# EAGLE design ethernet_poe (EAGLE 9.5.1)
REVISION: 1.0; TEAM: RoboRacing
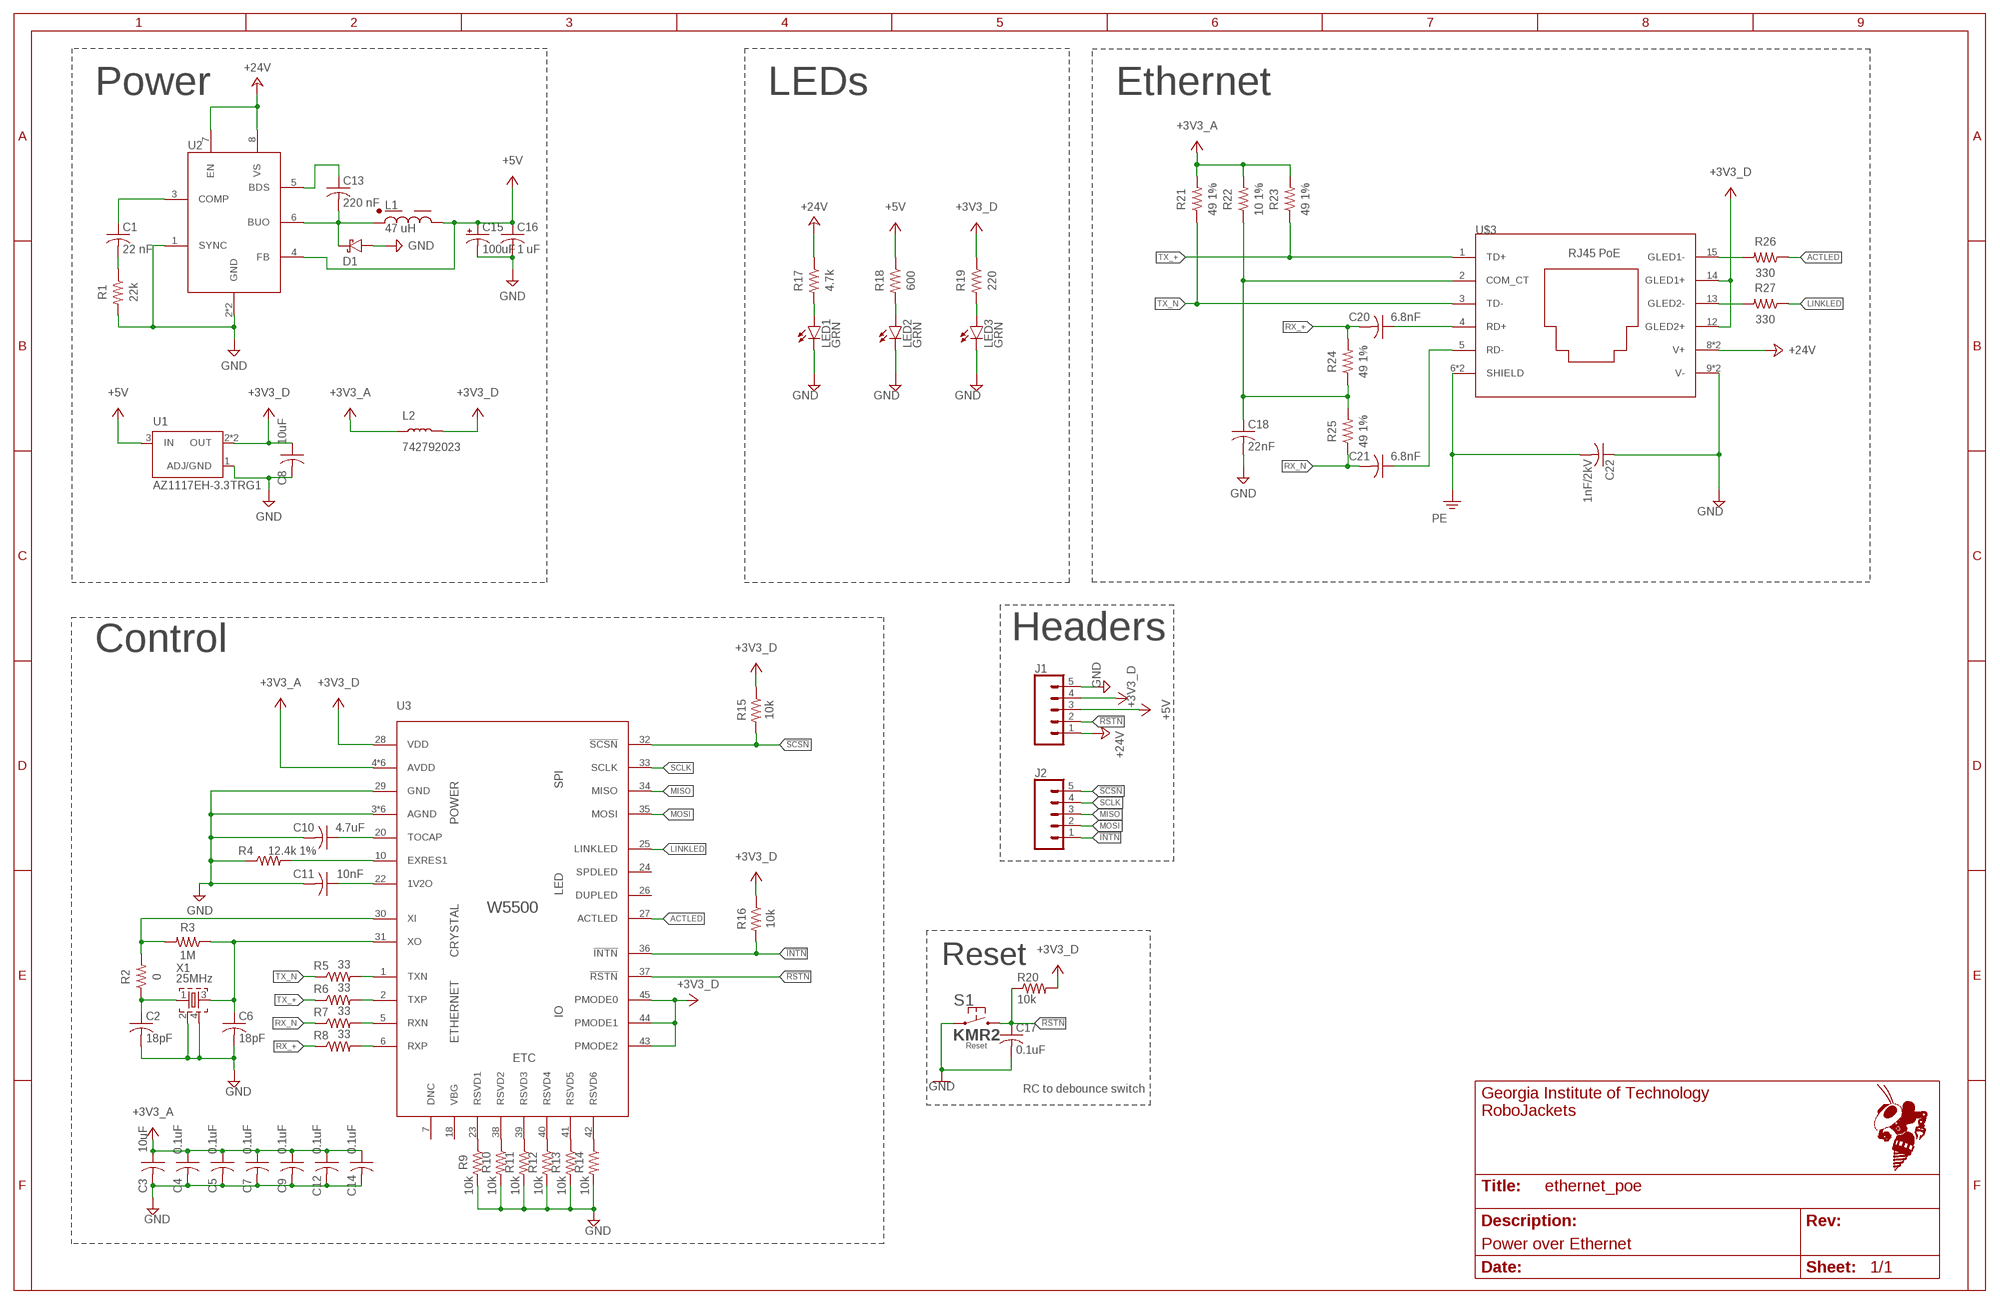
[diagram p0: schematic, sheet 1]
FRAME1 (FRAME_B_L): SCH_DESC: Power over Ethernet

## Parts
C1  22 nF  C-USC0603  [C0603]
C2  18pF  C-USC0603  [C0603]
C3  10uF  C-USC0603  [C0603]
C4  0.1uF  C-USC0603  [C0603]
C5  0.1uF  C-USC0603  [C0603]
C6  18pF  C-USC0603  [C0603]
C7  0.1uF  C-USC0603  [C0603]
C8  10uF  C-USC0603  [C0603]
C9  0.1uF  C-USC0603  [C0603]
C10  4.7uF  C-USC0603  [C0603]
C11  10nF  C-USC0603  [C0603]
C12  0.1uF  C-USC0603  [C0603]
C13  220 nF  C-USC0603  [C0603]
C14  0.1uF  C-USC0603  [C0603]
C15  100uF  CPOL-USE2-5  [E2-5]
C16  1 uF  C-USC0603  [C0603]
C17  0.1uF  C-USC0603  [C0603]
C18  22nF  C-USC0603  [C0603]
C20  6.8nF  C-USC0603  [C0603]
C21  6.8nF  C-USC0603  [C0603]
C22  1nF/2kV  C-USC1206  [C1206]
D1  SCHOTTKYSOD-323  [SOD-323]
J1  CONN_05  [1X05]
J2  CONN_05  [1X05]
L1  47 uH  744771147  [744771147]
L2  742792023  INDUCTOR_0805  [0805]
LED1  GRN  LEDCHIP-LED0603  [CHIP-LED0603]
LED2  GRN  LEDCHIP-LED0603  [CHIP-LED0603]
LED3  GRN  LEDCHIP-LED0603  [CHIP-LED0603]
R1  22k  R-US_R0603  [R0603]
R2  0  R-US_R0603  [R0603]
R3  1M  R-US_R0603  [R0603]
R4  12.4k 1%  R-US_R0603  [R0603]
R5  33  R-US_R0603  [R0603]
R6  33  R-US_R0603  [R0603]
R7  33  R-US_R0603  [R0603]
R8  33  R-US_R0603  [R0603]
R9  10k  R-US_R0603  [R0603]
R10  10k  R-US_R0603  [R0603]
R11  10k  R-US_R0603  [R0603]
R12  10k  R-US_R0603  [R0603]
R13  10k  R-US_R0603  [R0603]
R14  10k  R-US_R0603  [R0603]
R15  10k  R-US_R0603  [R0603]
R16  10k  R-US_R0603  [R0603]
R17  4.7k  R-US_R0603  [R0603]
R18  600  R-US_R0603  [R0603]
R19  220  R-US_R0603  [R0603]
R20  10k  R-US_R0603  [R0603]
R21  49 1%  R-US_R0603  [R0603]
R22  10 1%  R-US_R0603  [R0603]
R23  49 1%  R-US_R0603  [R0603]
R24  49 1%  R-US_R0603  [R0603]
R25  49 1%  R-US_R0603  [R0603]
R26  330  R-US_R0603  [R0603]
R27  330  R-US_R0603  [R0603]
S1  KMR2  [KMR2]
U1  AZ1117EH-3.3TRG1  [SOT230P700X180-4N]
U2  IFX91041  [SOIC-8-EXPOSED_PAD]
U3  W5500  [48-LQFP]
U$3  SI-52003-F  [SI-52003-F]
X1  25MHz  ABM10W-25.0000MHZ-6-K1Z-T3  [OSCILLATOR-SMD-2.5X2]

## Nets
3V3_LED: LED3.A R19.2
5V_LED: LED2.A R18.2
24V_LED: LED1.A R17.2
!INTN: J2.1 R16.2 U3.36(!INTN)
!RSTN: C17.1 J1.2 R20.1 S1.2.1 S1.2.2 U3.37(!RSTN)
!SCSN: J2.5 R15.2 U3.32(!SCSN)
+3V3_A: C3.1 C4.1 C5.1 C7.1 C9.1 C12.1 C14.1 L2.1 R21.2 R22.2 R23.2 U3.4(AVDD) U3.8(AVDD) U3.11(AVDD) U3.15(AVDD) U3.17(AVDD) U3.21(AVDD)
+3V3_D [power]: C8.1 J1.4 L2.2 R15.1 R16.1 R19.1 R20.2 U1.2(OUT) U1.4(OUT) U3.28(VDD) U3.43(PMODE2) U3.44(PMODE1) U3.45(PMODE0) U$3.12(GLED2+) U$3.14(GLED1+)
+5V: C15.+ C16.1 J1.3 L1.1 R18.1 U1.3(IN) U2.4(FB)
+24V: J1.1 R17.1 U2.7(EN) U2.8(VS) U$3.8(V+) U$3.10(V+)
ACTLED: R26.1 U3.27(ACTLED)
COM_CT: C18.1 R22.1 R24.1 R25.2 U$3.2(COM_CT)
GND: C2.2 C3.2 C4.2 C5.2 C6.2 C7.2 C8.2 C9.2 C10.2 C11.2 C12.2 C14.2 C15.- C16.2 C17.2 C18.2 C22.1 D1.A J1.5 LED1.C LED2.C LED3.C R1.2 R4.1 R9.2 R10.2 R11.2 R12.2 R13.2 R14.2 S1.1.1 S1.1.2 U1.1(ADJ/GND) U2.1(SYNC) U2.2(GND) U2.P$9(GND) U3.3(AGND) U3.9(AGND) U3.14(AGND) U3.16(AGND) U3.19(AGND) U3.29(GND) U3.48(AGND) U$3.9(V-) U$3.11(V-) X1.2(SHD1) X1.4(SHD2)
LINKLED: R27.1 U3.25(LINKLED)
MISO: J2.3 U3.34(MISO)
MOSI: J2.2 U3.35(MOSI)
N$1: R9.1 U3.23(RSVD1)
N$2: R10.1 U3.38(RSVD2)
N$3: R11.1 U3.39(RSVD3)
N$4: R5.2 U3.1(TXN)
N$5: R6.2 U3.2(TXP)
N$6: R12.1 U3.40(RSVD4)
N$7: R7.2 U3.5(RXN)
N$8: R8.2 U3.6(RXP)
N$9: C2.1 R2.1 X1.1(IN)
N$10: R27.2 U$3.13(GLED2-)
N$11: C6.1 R3.1 U3.31(XO) X1.3(OUT)
N$12: R26.2 U$3.15(GLED1-)
N$13: R2.2 R3.2 U3.30(XI)
N$14: C13.2 D1.C L1.P$2 U2.6(BUO)
N$15: C13.1 U2.5(BDS)
N$16: C1.2 R1.1
N$17: C1.1 U2.3(COMP)
N$18: C11.1 U3.22(1V2O)
N$19: C10.1 U3.20(TOCAP)
N$20: R13.1 U3.41(RSVD5)
N$21: R4.2 U3.10(EXRES1)
N$22: R14.1 U3.42(RSVD6)
PE: C22.2 U$3.6(SHIELD) U$3.7(SHIELD)
RD_+: C20.1 U$3.4(RD+)
RD_N: C21.1 U$3.5(RD-)
RX_+: C20.2 R8.1 R24.2
RX_N: C21.2 R7.1 R25.1
SCLK: J2.4 U3.33(SCLK)
TX_+: R6.1 R23.1 U$3.1(TD+)
TX_N: R5.1 R21.1 U$3.3(TD-)
Unconnected: U3.7(DNC) U3.18(VBG) U3.24(SPDLED) U3.26(DUPLED)

## Notes on the sheet
- Power | LEDs | Ethernet
- Headers
- Control
- Reset
- RC to debounce switch

## Library data of the parts
C1-C14 C16-C18 C20-C22 = rcl:C-US: CAPACITOR, American symbol; SPICEPREFIX: C
C15 = rcl:CPOL-US: POLARIZED CAPACITOR, American symbol; SPICEPREFIX: C
D1 = RoboJackets-Diodes:SCHOTTKY
J1 J2 = SparkFun-Connectors:CONN_05: Multi connection point. Often used as Generic Header-pin footprint for 0.1 inch spaced/style header connections On any of the 0.1 inch spaced packages, you can populate with these: Break Away Headers - Straight <https://www.sparkfun.com/products/116> (PRT-00116) Break Away Male Headers - Right Angle <https://www.sparkfun.com/products/553> (PRT-00553) Female Headers <https://www.sparkfun.com/products/115> (PRT-00115) Break Away Headers - Machine Pin <https://www.sparkfun.com/products/117> (PRT-00117) Break Away Female Headers - Swiss Machine Pin <https://www.sparkfun.com/products/743> (PRT-00743) For SCREWTERMINALS and SPRING TERMINALS visit here: Screw Terimnals on SparkFun.com <https://www.sparkfun.com/search/results?term=Screw+Terminals> (5mm/3.5mm/2.54mm spacing) This device is also useful as a general connection point to wire up your design to another part of your project. Our various solder wires solder well into these plated through hole pads. Hook-Up Wire - Assortment (Stranded, 22 AWG) <https://www.sparkfun.com/products/11375> (PRT-11375) Hook-Up Wire - Assortment (Solid Core, 22 AWG) <https://www.sparkfun.com/products/11367> (PRT-11367) View the entire wire category on our website here <https://www.sparkfun.com/categories/141> Special notes: Molex polarized connector foot print use with SKU : PRT-08231 with associated crimp pins and housings. 1MM SMD Version SKU: PRT-10208
L1 = ethernet_poe:744771147: Wurth Elektronik SMT Shielded Power Inductor; DKPN: 732-1214-1-ND
L2 = ethernet_poe:INDUCTOR_0805
LED1-LED3 = led:LED: LED OSRAM: - CHIPLED LG R971, LG N971, LY N971, LG Q971, LY Q971, LO R971, LY R971 LH N974, LH R974 LS Q976, LO Q976, LY Q976 LO Q996 - Hyper CHIPLED LW Q18S LB Q993, LB Q99A, LB R99A - SideLED LS A670, LO A670, LY A670, LG A670, LP A670 LB A673, LV A673, LT A673, LW A673 LH A674 LY A675 LS A676, LA A676, LO A676, LY A676, LW A676 LS A679, LY A679, LG A679 - Hyper Micro SIDELED® LS Y876, LA Y876, LO Y876, LY Y876 LT Y87S - SmartLED LW L88C, LW L88S LB L89C, LB L89S, LG L890 LS L89K, LO L89K, LY L89K LS L896, LA L896, LO L896, LY L896 - TOPLED LS T670, LO T670, LY T670, LG T670, LP T670 LSG T670, LSP T670, LSY T670, LOP T670, LYG T670 LG T671, LOG T671, LSG T671 LB T673, LV T673, LT T673, LW T673 LH T674 LS T676, LA T676, LO T676, LY T676, LB T676, LH T676, LSB T676, LW T676 LB T67C, LV T67C, LT T67C, LS T67K, LO T67K, LY T67K, LW E67C LS E67B, LA E67B, LO E67B, LY E67B, LB E67C, LV E67C, LT E67C LW T67C LS T679, LY T679, LG T679 LS T770, LO T770, LY T770, LG T770, LP T770 LB T773, LV T773, LT T773, LW T773 LH T774 LS E675, LA E675, LY E675, LS T675 LS T776, LA T776, LO T776, LY T776, LB T776 LHGB T686 LT T68C, LB T68C - Hyper Mini TOPLED® LB M676 - Mini TOPLED Santana® LG M470 LS M47K, LO M47K, LY M47K Source: http://www.osram.convergy.de LUXEON: - LUMILED® LXK2-PW12-R00, LXK2-PW12-S00, LXK2-PW14-U00, LXK2-PW14-V00 LXK2-PM12-R00, LXK2-PM12-S00, LXK2-PM14-U00 LXK2-PE12-Q00, LXK2-PE12-R00, LXK2-PE12-S00, LXK2-PE14-T00, LXK2-PE14-U00 LXK2-PB12-K00, LXK2-PB12-L00, LXK2-PB12-M00, LXK2-PB14-N00, LXK2-PB14-P00, LXK2-PB14-Q00 LXK2-PR12-L00, LXK2-PR12-M00, LXK2-PR14-Q00, LXK2-PR14-R00 LXK2-PD12-Q00, LXK2-PD12-R00, LXK2-PD12-S00 LXK2-PH12-R00, LXK2-PH12-S00 LXK2-PL12-P00, LXK2-PL12-Q00, LXK2-PL12-R00 Source: www.luxeon.com KINGBRIGHT: KA-3528ASYC Source: www.kingbright.com
R1-R27 = rcl:R-US_: RESISTOR, American symbol; SPICEPREFIX: R
S1 = RoboJackets-Switches:KMR2; FUNCTION: Reset
U1 = ethernet_poe:AZ1117EH-3.3TRG1: Ldo.Vreg Pos 3, 3v 1a Sot223; DKPN: AZ1117EH-3.3TRG1DICT-ND
U2 = ethernet_poe:IFX91041: 1.8A DC/DC Step-Down Voltage Regulator 5.0V, 3.3V, or Adjustable Output; DKPN: IFX91041EJV50XUMA1CT-ND
U3 = ethernet_poe:W5500: Chip to control 10/100 Ethernet and output data over SPI; DKPN: 1278-1021-ND
U$3 = ethernet_poe:SI-52003-F
X1 = ethernet_poe:ABM10W-25.0000MHZ-6-K1Z-T3: 25 MHz Oscillator; DKPN: 535-13730-1-ND

## Net classes
0 default: width 0.203 mm, drill 0.406 mm, clearance 0.203 mm
1 power: width 0.305 mm, drill 0.406 mm, clearance 0.203 mm to class 0, clearance 0.203 mm

## Board
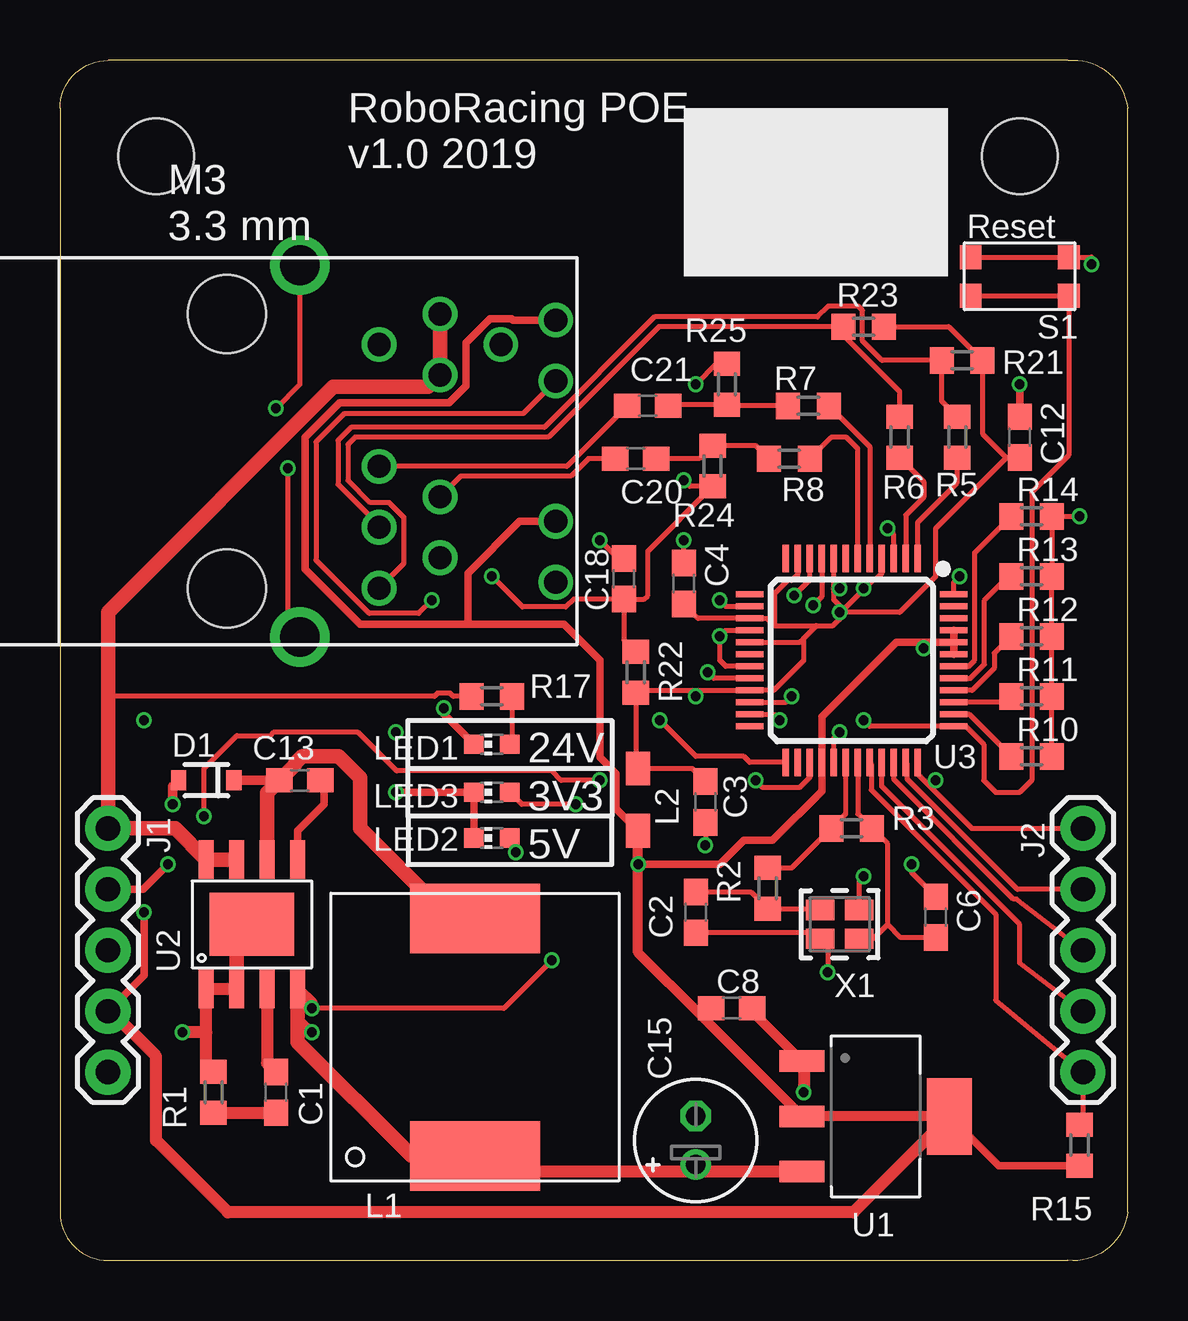
[diagram p1: board, top side]
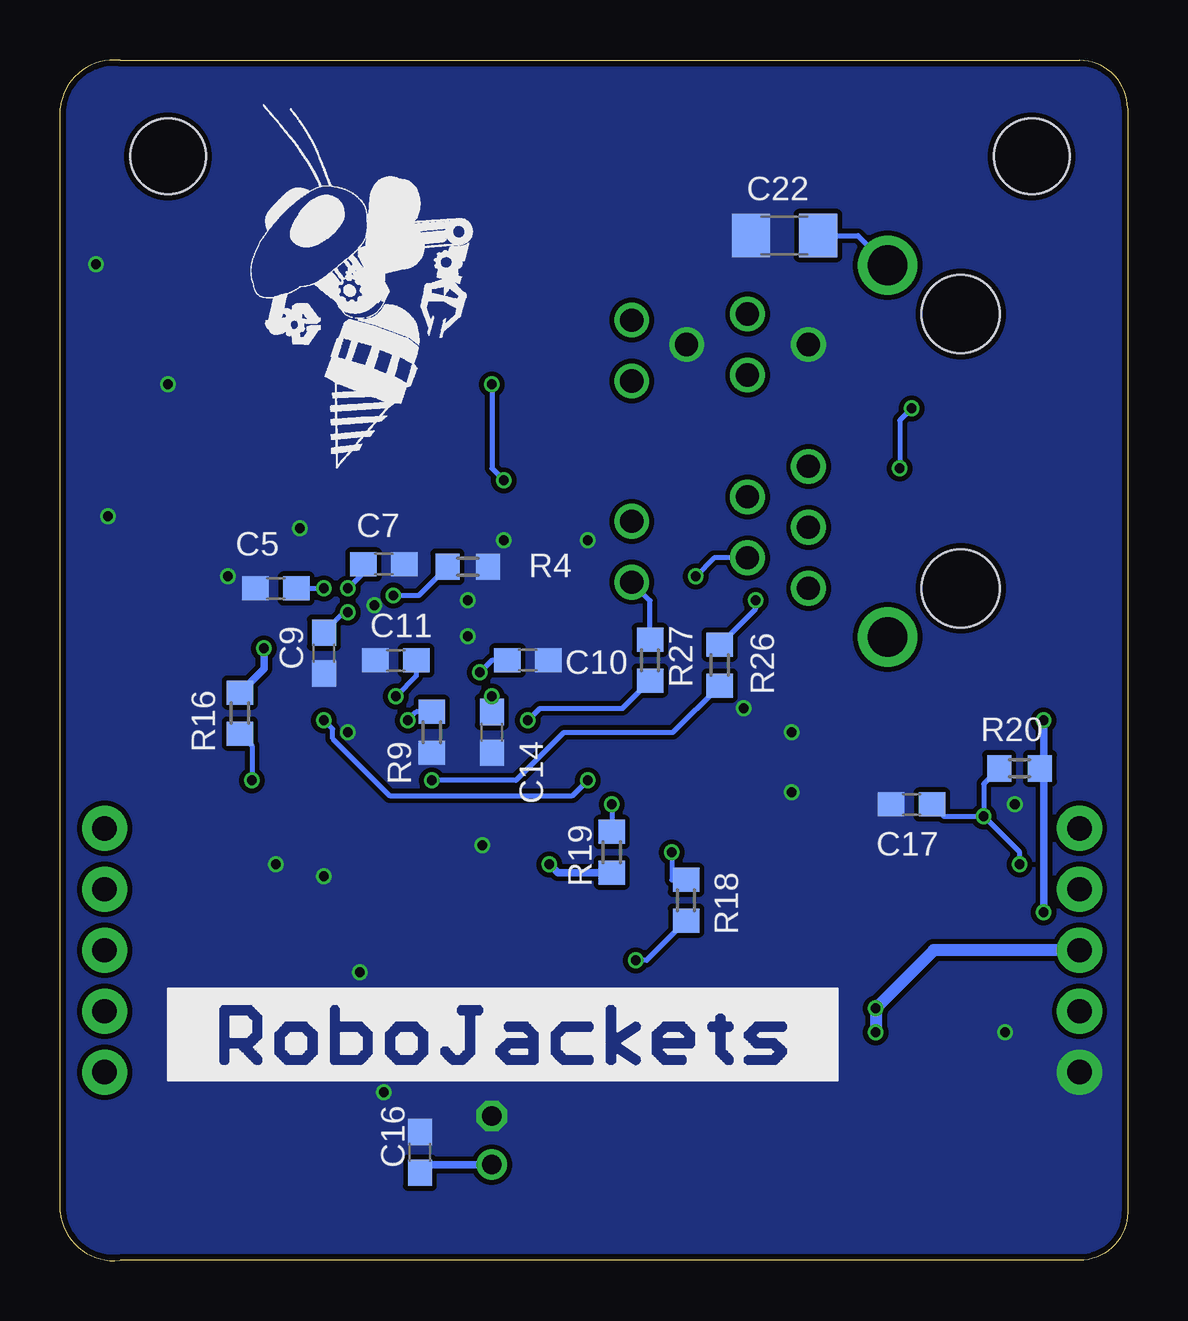
[diagram p2: board, bottom side, seen from below]

Size 44.5 x 50.03 mm. Coordinates in mm from the lower left corner, seen from the top.
Outline: 2,0.01 42,0.01 arc90 44.5,2.01 44.5,48.01 arc90 42,50.01 2,50.01 arc90 0,48.01 0,2.01 arc90 2,0.01
Copper layers (1*16): Top 0.018mm / dielectric 1.55mm / Bottom 0.018mm
Design rules "eC_2Layer_PClass6_BaseCopperO18_eCDefault": minimum track width 0.15mm, minimum drill 0.35mm, track to track 0.15mm, track to pad 0.15mm, pad to pad 0.15mm, via to via 0.15mm, smd to smd 0mil, copper to edge 0.25mm, drill to drill 0.35mm, minimum pad ring 0.175mm, minimum via ring 0.125mm, stop-mask expansion 0mil, vias tented up to drill 0.45mm, thermal gap 0.2mm
Holes 3.15 mm at 40,46.01 4,46.01

### Footprints (pad centres in the part's own frame; a part is rotated, then mirrored left to right if it is on the bottom)
C0603 = smd 1.1 x 1: 1 -0.85,0; 2 0.85,0
E2-5 = drill 0.813 pad 1.27: + -1.016,0 | drill 0.813 pad 1.27 octagon: - 1.016,0
C1206 = smd 1.6 x 1.8: 1 -1.4,0; 2 1.4,0
SOD-323 = smd 0.63 x 0.83: A 1.15,0; C -1.15,0
1X05 = drill 1.016 pad 1.88: 1 0,0; 2 2.54,0; 3 5.08,0; 4 7.62,0; 5 10.16,0
744771147 = smd 5.4 x 2.9: 1 0,4.95; P$2 0,-4.95
0805 = smd 1.4 x 1: 1 -1.3,0; 2 1.3,0
CHIP-LED0603 = smd 0.8 x 0.8: A 0,-0.75; C 0,0.75
R0603 = smd 1 x 1.1: 1 -0.85,0; 2 0.85,0
KMR2 = smd 0.9 x 1: 1.1 -2.05,0.8; 1.2 2.05,0.8; 2.1 -2.05,-0.8; 2.2 2.05,-0.8
SOT230P700X180-4N = smd 1.86 x 0.9: 1 -3.075,2.3; 2 -3.075,0; 3 -3.075,-2.3 | smd 1.86 x 3.19: 4 3.075,0
SOIC-8-EXPOSED_PAD = smd 1.6 x 0.61: 1 -2.7,1.905; 2 -2.7,0.635; 3 -2.7,-0.635; 4 -2.7,-1.905; 5 2.7,-1.905; 6 2.7,-0.635; 7 2.7,0.635; 8 2.7,1.905 | smd 2.62 x 3.51: P$9 0,0
48-LQFP = smd 1.143 x 0.254: 1 -4.25,2.75; 2 -4.25,2.25; 3 -4.25,1.75; 4 -4.25,1.25; 5 -4.25,0.75; 6 -4.25,0.25; 7 -4.25,-0.25; 8 -4.25,-0.75; 9 -4.25,-1.25; 10 -4.25,-1.75; 11 -4.25,-2.25; 12 -4.25,-2.75; 25 4.25,-2.75; 26 4.25,-2.25; 27 4.25,-1.75; 28 4.25,-1.25; 29 4.25,-0.75; 30 4.25,-0.25; 31 4.25,0.25; 32 4.25,0.75; 33 4.25,1.25; 34 4.25,1.75; 35 4.25,2.25; 36 4.25,2.75 | smd 0.254 x 1.143: 13 -2.75,-4.25; 14 -2.25,-4.25; 15 -1.75,-4.25; 16 -1.25,-4.25; 17 -0.75,-4.25; 18 -0.25,-4.25; 19 0.25,-4.25; 20 0.75,-4.25; 21 1.25,-4.25; 22 1.75,-4.25; 23 2.25,-4.25; 24 2.75,-4.25; 37 2.75,4.25; 38 2.25,4.25; 39 1.75,4.25; 40 1.25,4.25; 41 0.75,4.25; 42 0.25,4.25; 43 -0.25,4.25; 44 -0.75,4.25; 45 -1.25,4.25; 46 -1.75,4.25; 47 -2.25,4.25; 48 -2.75,4.25
SI-52003-F = drill 0.965: 1 0,0; 2 -1.27,2.54; 3 -2.54,0; 4 -3.81,2.54; 5 -5.08,0; 8 -8.89,2.54; 9 -10.16,0; 10 -11.43,2.54; 11 -10.16,5.08; 12 -2.794,7.366; 13 -0.254,7.366; 14 -11.176,7.366; 15 -8.636,7.366 | drill 1.651: 6 2.032,-3.302; 7 -13.462,-3.302 | hole 3.251: 0,-6.35; -11.43,-6.35
OSCILLATOR-SMD-2.5X2 = smd 1.2 x 0.85: 1 -0.812,0.6; 2 0.812,0.6; 3 0.812,-0.6; 4 -0.812,-0.6

### Placement (x,y rotation side)
C1  9,7.01 270 top
C2  26.5,14.51 270 top
C3  26.9,19.11 270 top
C4  26,28.21 90 top
C5  35.5,28.01 180 bottom
C6  36.5,14.31 90 top
C7  31,29.01 0 bottom
C8  28,10.51 0 top
C9  33.5,25.31 270 bottom
C10  25,25.01 0 bottom
C11  30.5,25.01 180 bottom
C12  40,34.31 90 top
C13  10,20.01 180 top
C14  26.5,22.01 270 bottom
C15  26.5,5.01 90 top
C16  29.5,4.51 90 bottom
C17  9,19.01 180 bottom
C18  23.5,28.41 90 top
C20  24,33.41 0 top
C21  24.5,35.61 0 top
C22  14.3,42.71 0 bottom
D1  6.1,20.01 180 top
J1  2,18.01 270 top
J2  42.64,18.01 270 top
L1  17.3,9.31 180 top
L2  24.1,19.21 270 top
LED1  18,21.51 90 top
LED2  18,17.61 90 top
LED3  18,19.51 90 top
R1  6.4,7.01 90 top
R2  29.5,15.51 90 top
R3  33,18.01 180 top
R4  27.5,28.91 180 bottom
R5  37.4,34.31 270 top
R6  35,34.31 270 top
R7  31.2,35.61 0 top
R8  30.4,33.41 0 top
R9  29,22.01 270 bottom
R10  40.5,21.01 0 top
R11  40.5,23.51 0 top
R12  40.5,26.01 0 top
R13  40.5,28.51 0 top
R14  40.5,31.01 0 top
R15  42.5,4.81 90 top
R16  37,22.81 270 bottom
R17  18,23.51 0 top
R18  18.4,15.01 90 bottom
R19  21.5,17.01 90 bottom
R20  4.5,20.51 0 bottom
R21  37.6,37.51 0 top
R22  24,24.51 270 top
R23  33.5,38.91 0 top
R24  27.2,33.11 90 top
R25  27.8,36.51 90 top
R26  17,24.81 90 bottom
R27  19.9,25.01 90 bottom
S1  40,41.01 0 top
U1  34,6.01 0 top
U2  8,14.01 90 top
U3  33,25.01 270 top
U$1  [ROBOJACKETS]  40,7.51 0 bottom
U$2  [ROBOBUZZ_0.8X]  33,33.01 0 bottom
U$3  13.3,28.01 270 top
X1  32.5,14.01 0 top

### Tracks (layer width: path | path; a pad name or v marks a point on that pad's centre or on a via)
3V3_LED  (via drill 0.41)
  Top 0.203: LED3.A 19.25,19.01 v21.5,19.01
  Bottom 0.203: v21.5,19.01 R19.2
5V_LED  (via drill 0.41)
  Top 0.203: LED2.A 19,17.36 v19,17.01
  Bottom 0.203: v19,17.01 19,15.86 R18.2
24V_LED
  Top 0.203: R17.2 18.85,21.61 LED1.A
!INTN  (via drill 0.41)
  Top 0.203: U3.36 35.75,20.26 36.25,19.76 | J2.1 38,18.01 36.25,19.76 | v36.5,20.01 36.25,19.76
  Bottom 0.203: R16.2 36.5,21.46 v36.5,20.01
!RSTN  (via drill 0.41)
  Top 0.203: v33.5,22.51 33.75,22.26 U3.37 37.75,22.26 38.5,21.51 38.5,20.01 39,19.51 40,19.51 40.5,20.01 40.5,32.01 42.05,33.56 S1.2.2 S1.2.1 | v6,18.51 6,20.51 7.37,21.88 8.76,21.88 8.89,22.01 12.43,22.01 14.04,20.4 20.51,20.4 20.89,20.01 v22.5,20.01
  Top 0.305: J1.2 3.46,15.47 v4.5,16.51
  Bottom 0.203: v4.5,16.51 4.5,17.01 v6,18.51 | v33.5,22.51 33.13,22.15 33.13,21.75 30.76,19.38 23.13,19.38 v22.5,20.01 | R20.1 6,19.86 v6,18.51 | C17.1 7.65,18.51 v6,18.51
!SCSN
  Top 0.203: U3.32 33.82,20.7 33.82,19.62 39,14.44 39,10.85 J2.5 42.64,6.14 R15.2
+3V3_A  (via drill 0.41)
  Top 0.203: 29.77,26.46 31.53,26.46 | 31.53,26.46 32.23,26.46 32.55,26.79 32.55,27.01 | 32.55,27.01 32.55,27.24 32.25,27.54 32.25,28.01 | 29.77,26.46 29.47,26.76 U3.15 26.6,26.76 C4.1 | 32.25,28.01 U3.8 | 31.53,26.46 31,25.94 | 31,25.94 31,25.01 29.75,23.76 U3.21 26.5,23.76 | U3.17 30.83,25.76 31,25.94 | 26.5,23.76 24.1,23.76 R22.2 24,20.61 L2.1 26.35,20.51 C3.1 | R23.2 37.05,38.91 R21.2 38.45,34.46 39.45,33.46 | 33.52,27.99 33.92,28.39 34,28.39 34.25,28.63 U3.4 | 33.52,27.99 32.55,27.01 | 32.55,27.01 35,27.01 36.5,28.51 36.5,30.51 39.45,33.46 | U3.11 30.75,28.6 30.5,28.35 30.34,28.35 29.77,27.78 29.77,26.46 | 39.45,33.46 C12.1 | v32.5,28.01 32.25,28.01 | v32.5,27.01 32.55,27.01 | v26.5,23.51 26.5,23.76 | v33.5,28.01 33.52,27.99
  Bottom 0.203: v32.5,27.01 32.65,27.01 C9.1 | v32.5,28.01 31.85,28.66 C7.1 | C5.1 v33.5,28.01 | C14.1 v26.5,23.51
+3V3_D  (via drill 0.41)
  Top 0.305: U3.45 U3.44 | U3.44 U3.43 | U3.44 36,25.76 | 36,25.76 34.85,25.76 31.75,22.66 U3.28 31.75,19.56 29.7,17.51 28.5,17.51 27.5,16.51 v24.1,16.51 | v36,25.51 36,25.76 | C8.1 26.86,10.23 26.71,10.23 | R15.1 39.12,3.96 U1.4 | J1.4 3.5,11.89 v3.5,14.51 | U$3.14 18.89,39.19 18.83,39.25 17.93,39.25 16.92,38.24 16.92,36.46 16.21,35.75 11.66,35.75 10.21,34.3 10.21,28.8 12.5,26.51 17,26.51 | L2.2 23.18,18.83 23.18,20.3 22.5,20.98 22.5,25.01 21,26.51 17,26.51 | U$3.12 19.17,30.81 17,28.64 17,26.51
  Top 0.406: U1.4 U1.2 26.71,10.23 24.1,12.84 v24.1,16.51 L2.2
  Top 0.5: U1.4 33.08,2.01 7,2.01 4,5.01 4,8.51 2.12,10.39 J1.4
  Bottom 0.305: v24.1,16.51 23.75,16.16 R19.1 | v3.5,22.51 3.5,20.51 | 3.5,20.51 v3.5,14.51 | R20.2 3.5,20.51 | R16.1 36,24.66 v36,25.51
+5V  (via drill 0.41)
  Top 0.203: v20.5,12.51 18.5,10.51 v10.5,10.51
  Top 0.3: L1.1 14.65,4.36
  Top 0.305: C15.+ 26.5,3.71
  Top 0.5: U1.3 26.5,3.71 17.95,3.71 L1.1 | U2.4 10.5,10.72 v10.5,10.51 | 9.9,10.01 10.4,9.51 v10.5,9.51
  Top 0.6: U2.4 9.9,10.01 9.9,9.11 14.65,4.36
  Bottom 0.203: R18.1 20.05,12.51 v20.5,12.51
  Bottom 0.305: C16.1 29.17,4 C15.+
  Bottom 0.5: J1.3 8.08,12.93 v10.5,10.51 v10.5,9.51
+24V
  Top 0.203: R17.1 16.39,23.51 16.26,23.65 15.74,23.65 15.61,23.51 2,23.51
  Top 0.6: U2.7 U2.8 4.79,18.01 J1.1 2,23.51 2,27.01 11.39,36.4 15.34,36.4 U$3.8 U$3.10
ACTLED  (via drill 0.41)
  Top 0.203: U3.27 31.25,20.13 30.83,19.71 29.3,19.71 v29,20.01
  Bottom 0.203: v29,20.01 25.5,20.01 23.5,22.01 18.95,22.01 R26.1
COM_CT  (via drill 0.41)
  Top 0.203: C18.1 23.5,25.86 R22.1 | C18.1 24.35,27.56 24.5,27.71 24.5,29.56 R24.1 26.25,32.26 v26,32.51 | R25.2 27.35,37.36 v26.5,36.51 | C18.1 21.42,27.56 21.09,27.24 19.27,27.24 v18,28.51
  Bottom 0.203: v26.5,36.51 26.5,33.01 v26,32.51 | U$3.2 17.23,29.28 v18,28.51
GND  (via drill 0.41)
  Top 0.203: U3.16 27.75,26.26 v27.5,26.01 27.5,25.01 27.75,24.76 U3.19 | v37.5,28.51 37.25,28.26 U3.48 | U3.3 34.75,30.26 v34.5,30.51 | U3.29 32.25,21.76 v32.5,22.01 | C2.2 31.44,13.66 X1.4 32,13.1 v32,12.01 | v42.5,31.01 R14.2 R13.2 R12.2 R11.2 R10.2 | U3.9 31.75,27.66 v31.4,27.31 | S1.1.1 S1.1.2 43,41.81 v43,41.51 | v35.5,16.51 35.5,16.16 C6.2 | X1.2 33.31,15.83 v33.5,16.01 | C4.2 v26,30.01 | C18.2 23.25,29.26 v22.5,30.01 | v27.5,27.51 27.75,27.26 U3.14 | C3.2 v26.9,17.31
  Top 0.305: LED1.C 16,22.76 v16,23.01 | v14,19.51 LED3.C LED2.C | v40,36.51 C12.2
  Top 0.4: D1.A 4.7,19.76 v4.7,19.01
  Top 0.406: U1.1 28.85,10.39 C8.2
  Top 0.5: U2.2 U2.1 6.09,9.51 | R1.2 6.09,8.17 6.09,9.51 | U1.1 31,8.24 v31,7.01 | 6.09,9.51 v5.1,9.51
  Top 0.6: U2.P$9 7.37,13.38 U2.2
  other vias: 14,22.01
  pour Bottom (no thermals): 0,50.01 44.5,50.01 44.5,0.01 0,0.01
LINKLED  (via drill 0.41)
  Top 0.203: U3.25 28.75,20.76 28.5,21.01 26.5,21.01 v25,22.51
  Bottom 0.203: v25,22.51 24.5,23.01 21.05,23.01 R27.1
MISO
  Top 0.203: J2.3 39.87,15.07 39.74,15.07 34.75,20.06 U3.34
MOSI
  Top 0.203: U3.35 35.32,20.7 35.32,20.07 39.91,15.47 J2.2
N$1  (via drill 0.41)
  Top 0.203: v30,22.51 29.75,22.76 U3.23
  Bottom 0.203: v30,22.51 29.65,22.86 R9.1
N$2
  Top 0.203: R10.1 37.9,22.76 U3.38
N$3
  Top 0.203: R11.1 39.4,23.26 U3.39
N$4
  Top 0.203: U3.1 35.75,30.76 37.4,32.41 R5.2
N$5
  Top 0.203: R6.2 36,32.46 36,31.81 35.25,31.06 U3.2
N$6
  Top 0.203: R12.1 38.95,25.31 38.95,24.68 38.03,23.76 U3.40
N$7
  Top 0.203: R7.2 33.75,33.91 U3.5
N$8
  Top 0.203: U3.6 33.25,33.84 32.79,34.3 32.14,34.3 R8.2
N$9
  Top 0.203: C2.1 28.8,15.36 R2.1 31.64,14.66 X1.1
N$10
  Bottom 0.203: R27.2 19.9,27.5 U$3.13
N$11
  Top 0.203: U3.31 33.25,18.61 R3.1 34.5,17.36 34.5,14.01 | C6.1 35.05,13.46 34.5,14.01 | X1.3 33.9,13.41 34.5,14.01
N$12  (via drill 0.41)
  Top 0.203: U$3.15 19.31,35.29 11.85,35.29 10.67,34.11 10.67,29.19 12.89,26.97 14.96,26.97 v15.5,27.51
  Bottom 0.203: R26.2 15.5,27.16 v15.5,27.51
N$13
  Top 0.203: U3.30 32.75,18.61 R3.2 30.5,16.36 R2.2
N$14
  Top 0.4: C13.2 D1.C
  Top 0.6: U2.6 8.63,19.5 C13.2 9.8,20.66 9.8,20.72 10.09,21.02 11.61,21.02 12.5,20.13 12.5,18.01 16.25,14.26 L1.P$2
N$15
  Top 0.305: U2.5 9.9,17.92 11,19.01 11,19.86 C13.1
N$16
  Top 0.5: R1.1 C1.2
N$17
  Top 0.508: U2.3 8.63,8.23 C1.1
N$18  (via drill 0.41)
  Top 0.203: U3.22 30.25,23.26 v30.5,23.51
  Bottom 0.203: C11.1 29.65,24.36 v30.5,23.51
N$19  (via drill 0.41)
  Top 0.203: U3.20 27.25,24.26 v27,24.51
  Bottom 0.203: C10.1 26.5,25.01 v27,24.51
N$20
  Top 0.203: R13.1 39.54,28.51 38.54,27.51 38.54,24.85 37.95,24.26 U3.41
N$21  (via drill 0.41)
  Top 0.203: v30.6,27.71 31.25,28.36 U3.10
  Bottom 0.203: R4.2 29.55,27.71 v30.6,27.71
N$22
  Top 0.203: R14.1 38.13,29.5 38.13,25.02 37.88,24.76 U3.42
PE  (via drill 0.41)
  Top 0.203: U$3.7 10,36.51 v9,35.51 | U$3.6 9.5,26.48 v9.5,33.01
  Bottom 0.203: C22.2 11.24,42.71 U$3.7 | v9,35.51 9.5,35.01 v9.5,33.01
RD_+
  Top 0.203: U$3.4 16.7,32.69 21.3,32.69 22.02,33.41 C20.1
RD_N
  Top 0.203: C21.1 21.13,33.09 U$3.5
RX_+
  Top 0.203: R8.1 29,33.96 R24.2 26.65,33.41 C20.2
RX_N
  Top 0.203: R7.1 27.85,35.61 R25.1 25.4,35.66 C21.2
SCLK
  Top 0.203: J2.4 40,12.39 40,14.01 34.25,19.76 U3.33
TX_+
  Top 0.203: R6.1 35,36.21 32.65,38.56 R23.1 24.96,38.91 20.36,34.31 12.3,34.31 12,34.01 12,32.51 12.93,31.58 13.73,31.58 14.33,30.98 14.33,29.04 U$3.1
TX_N
  Top 0.203: R5.1 36.75,35.81 R21.1 34.27,37.51 33.45,38.33 33.45,39.59 33.28,39.77 32.02,39.77 31.57,39.32 24.79,39.32 20.19,34.72 12.13,34.72 11.59,34.18 11.59,32.35 13.3,30.64 U$3.3

### Text on the board
tPlace: RoboRacing POE / v1.0 2019 | M3 / 3.3 mm | 24V | 3V3 | 5V